# Altium schematic sheet plc_module_xs.00001.001_Top.SchDoc: =GlobalProjectName
size 410 x 297 mm; ApprovedBy: Утвердил; CheckedBy: Проверил; Author: Разработал; SheetNumber: Лист; SheetTotal: Листов; PageSetup: Record=PageOptions|CenterHorizontal=True|CenterVertical=True|PrintScale=1.00|XCorrection=1.00|YCorrection=1.00|PrintKind=1|BorderSize=5000000|LeftOffset=0|BottomOffset=0|Orientation=2|PaperLength=1000|PaperWidth=1000|Scale=100|PaperSource=15|PrintQuality=1200|MediaType=1|DitherType=10|PaperKind=A3|PrintScaleMode=1; Weight: -; ScaleFactor: -; NormInspection: Норм.Контр.
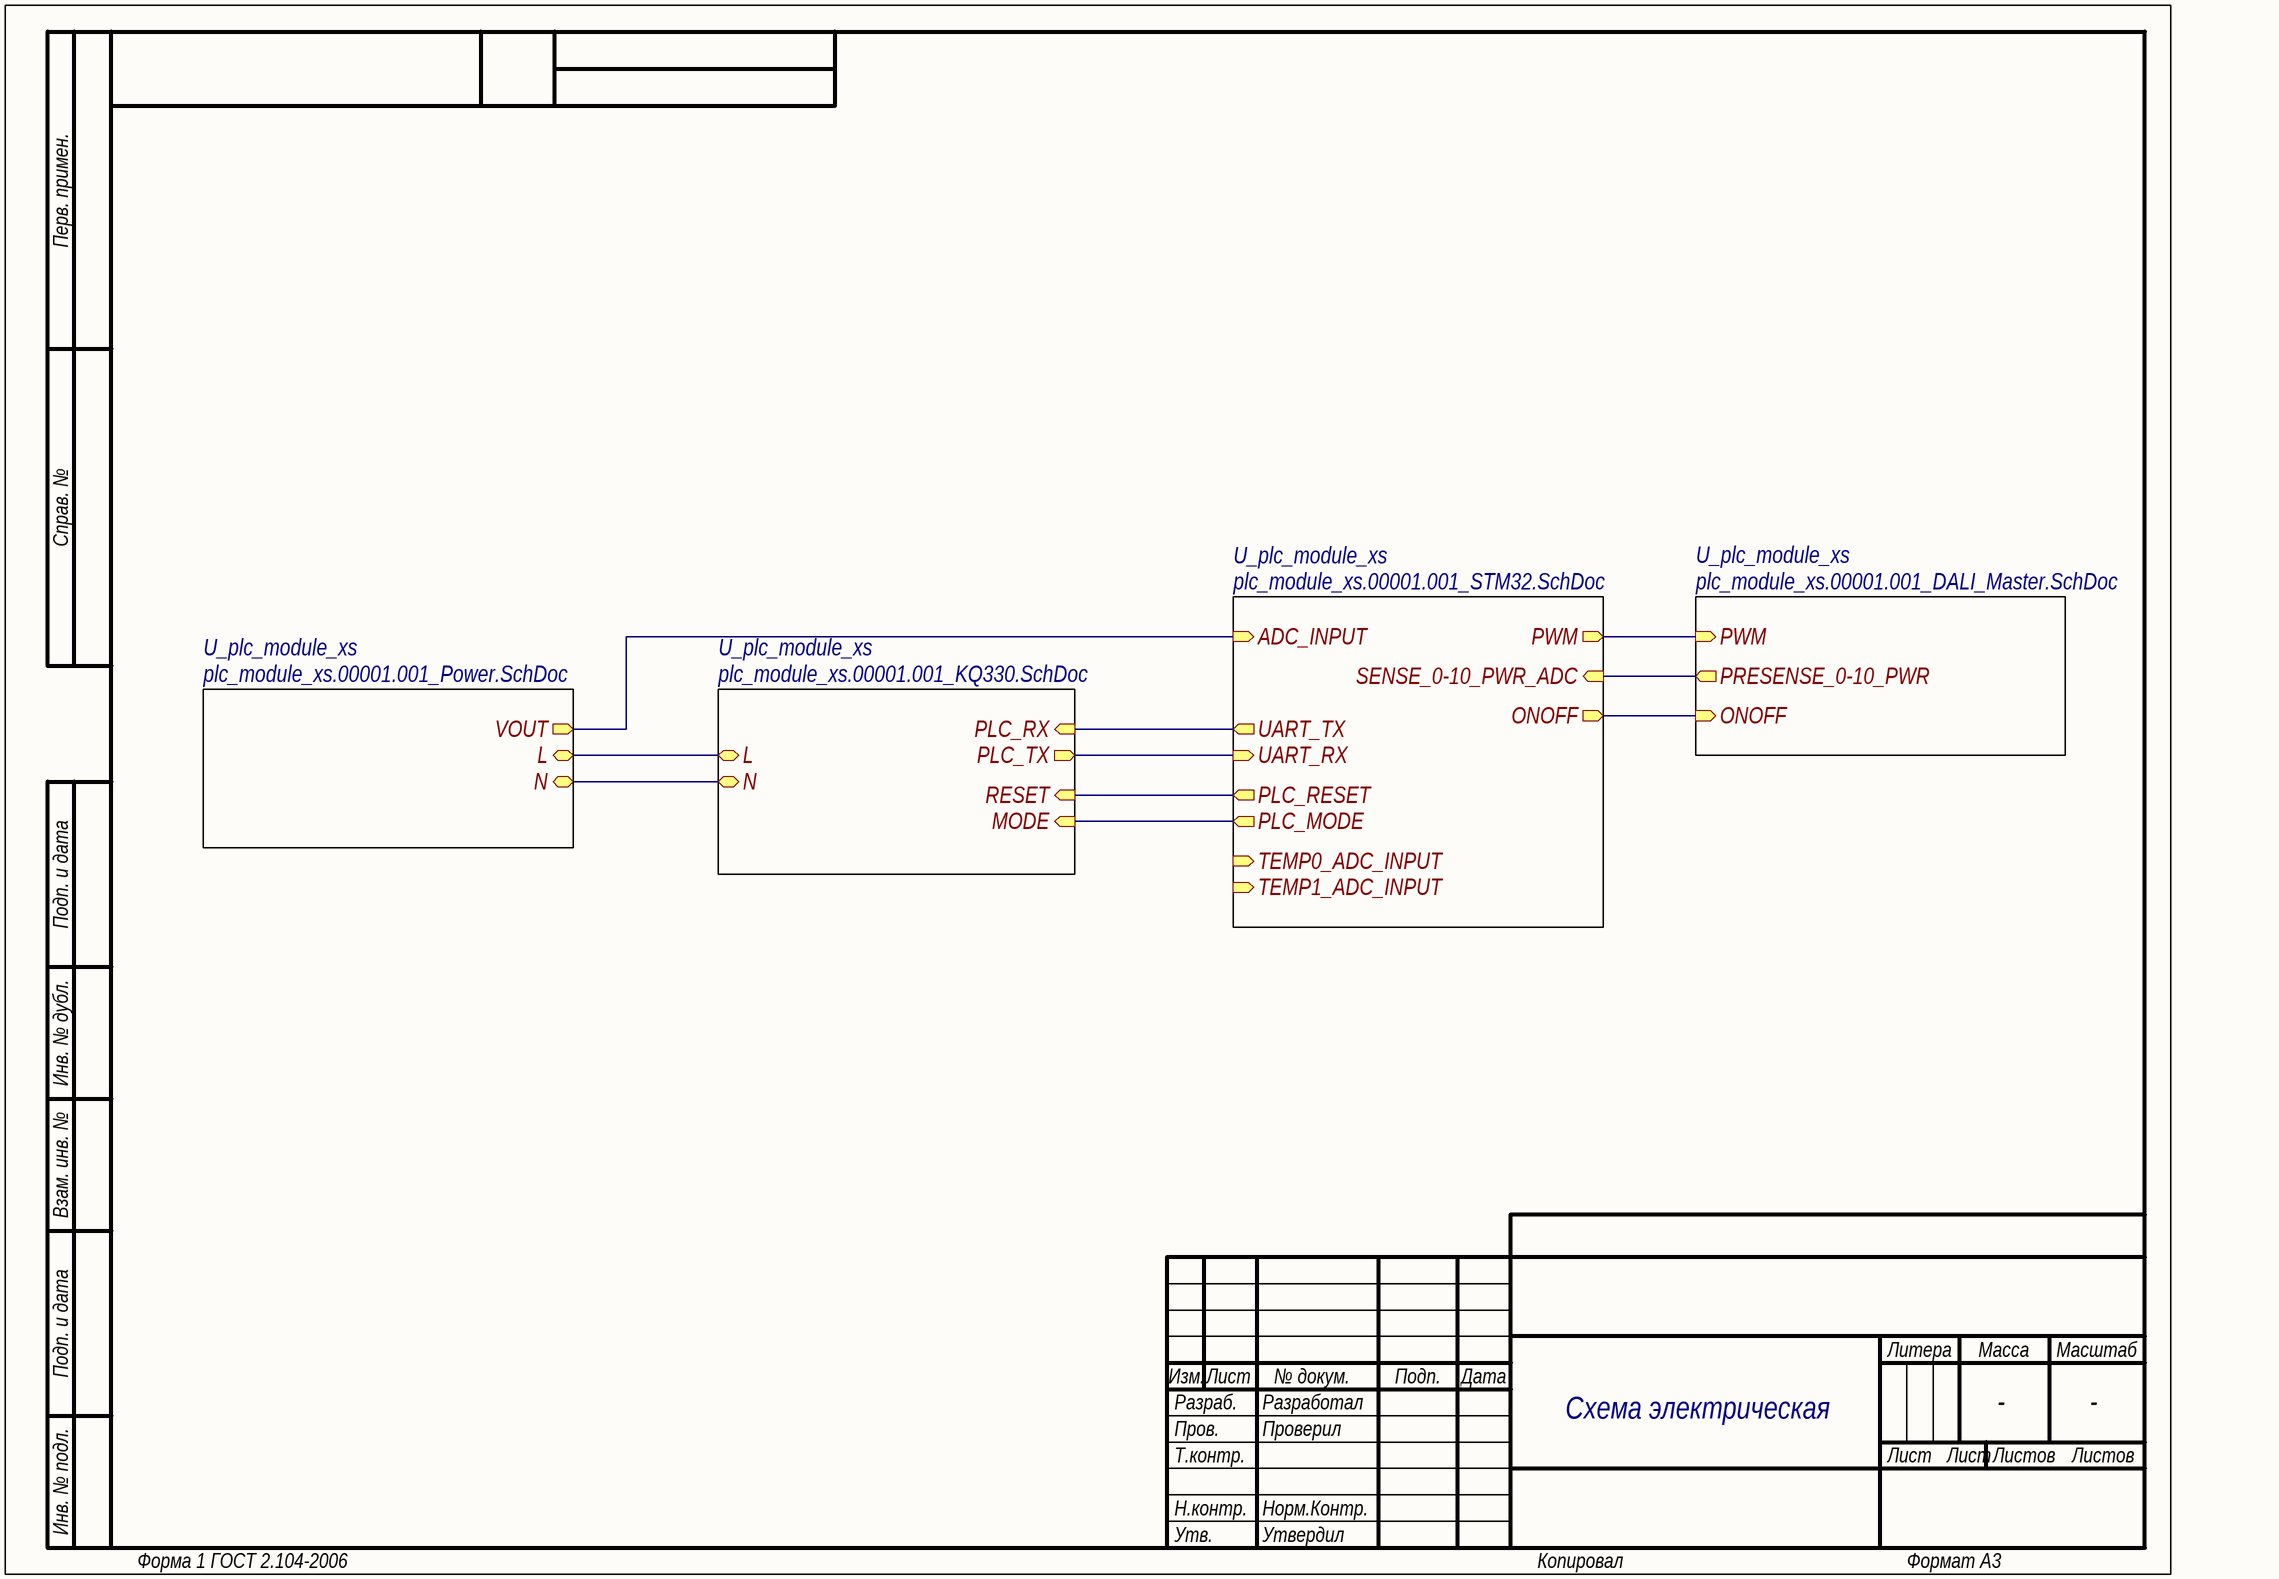
[diagram p0: plc_module_xs.00001.001_Top.SchDoc]

## Sub-sheets
U_plc_module_xs = plc_module_xs.00001.001_STM32.SchDoc: UART_TX (out), UART_RX (in), PLC_MODE (out), PLC_RESET (out), PWM (out), ADC_INPUT (in), SENSE_0-10_PWR_ADC (in), TEMP0_ADC_INPUT (in), TEMP1_ADC_INPUT (in), ONOFF (out)
U_plc_module_xs = plc_module_xs.00001.001_DALI_Master.SchDoc: PWM (in), PRESENSE_0-10_PWR (out), ONOFF (in)
U_plc_module_xs = plc_module_xs.00001.001_KQ330.SchDoc: MODE (in), N, RESET (in), L, PLC_RX (in), PLC_TX (out)
U_plc_module_xs = plc_module_xs.00001.001_Power.SchDoc: L, N, VOUT (out)

## Nets
(unnamed): sheet U_plc_module_xs/UART_TX, sheet U_plc_module_xs/PLC_RX
(unnamed): sheet U_plc_module_xs/UART_RX, sheet U_plc_module_xs/PLC_TX
(unnamed): sheet U_plc_module_xs/PLC_MODE, sheet U_plc_module_xs/MODE
(unnamed): sheet U_plc_module_xs/PLC_RESET, sheet U_plc_module_xs/RESET
(unnamed): sheet U_plc_module_xs/PWM, sheet U_plc_module_xs/PWM
(unnamed): sheet U_plc_module_xs/ADC_INPUT, sheet U_plc_module_xs/VOUT
(unnamed): sheet U_plc_module_xs/SENSE_0-10_PWR_ADC, sheet U_plc_module_xs/PRESENSE_0-10_PWR
(unnamed): sheet U_plc_module_xs/ONOFF, sheet U_plc_module_xs/ONOFF
(unnamed): sheet U_plc_module_xs/N, sheet U_plc_module_xs/N
(unnamed): sheet U_plc_module_xs/L, sheet U_plc_module_xs/L

## Notes on the sheet
- Схема электрическая
  принципиальная
- Перв. примен.
- Справ. №
- Подп. и дата
- Инв. № дубл.
- Взам. инв. №
- Разраб.
- Изм.
- Лист
- № докум.
- Подп.
- Дата
- Литера
- Масса
- Масштаб
- Пров.
- Т.контр.
- Листов
- Инв. № подл.
- Н.контр.
- Утв.
- Форма 1 ГОСТ 2.104-2006
- Копировал
- Формат А3